# EAGLE design strobe (EAGLE 9.0.1)
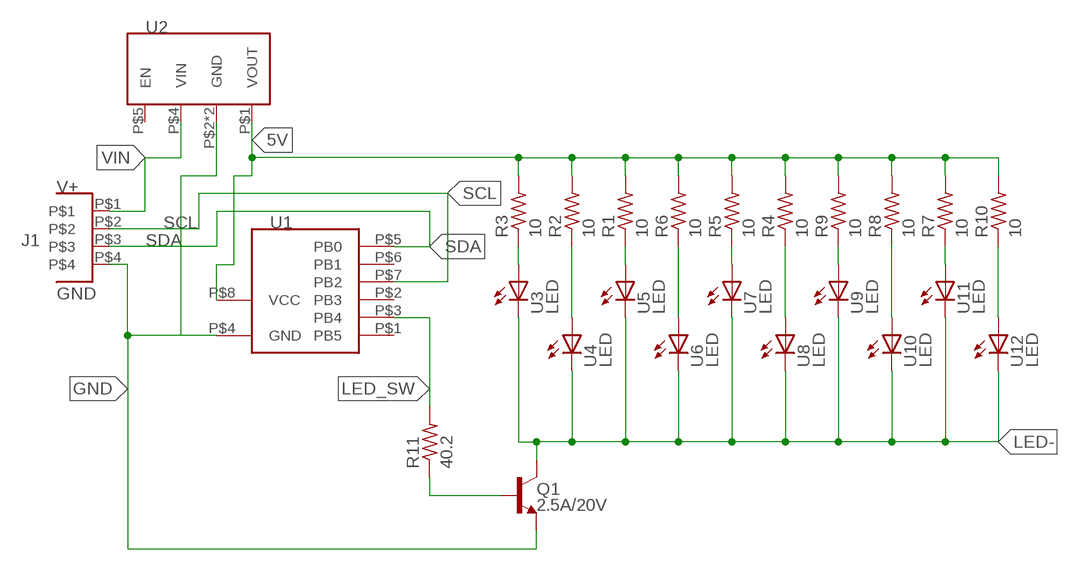
[diagram p0: schematic, sheet 1]

## Parts
J1  MOLEX-04365004  [MOLEX-43650-04]
Q1  2.5A/20V  TRANS_NPN-MMBT2222AL  [SOT23-3]
R1  10  R-US_R0805  [R0805]
R2  10  R-US_R0805  [R0805]
R3  10  R-US_R0805  [R0805]
R4  10  R-US_R0805  [R0805]
R5  10  R-US_R0805  [R0805]
R6  10  R-US_R0805  [R0805]
R7  10  R-US_R0805  [R0805]
R8  10  R-US_R0805  [R0805]
R9  10  R-US_R0805  [R0805]
R10  10  R-US_R0805  [R0805]
R11  40.2  R-US_R0805  [R0805]
U1  ATTINY85  [8P3]
U2  D24V25F5  [D24V25F5]
U3  LED  [3030]
U4  LED  [3030]
U5  LED  [3030]
U6  LED  [3030]
U7  LED  [3030]
U8  LED  [3030]
U9  LED  [3030]
U10  LED  [3030]
U11  LED  [3030]
U12  LED  [3030]

## Nets
5V: R1.2 R2.2 R3.2 R4.2 R5.2 R6.2 R7.2 R8.2 R9.2 R10.2 U1.P$8(VCC) U2.P$1(VOUT)
GND: J1.P$4 Q1.2(E) U1.P$4(GND) U2.P$2(GND) U2.P$3(GND)
LED-: Q1.3(C) U3.CATH(C) U4.CATH(C) U5.CATH(C) U6.CATH(C) U7.CATH(C) U8.CATH(C) U9.CATH(C) U10.CATH(C) U11.CATH(C) U12.CATH(C)
LED_SW: R11.2 U1.P$3(PB4)
N$5: R3.1 U3.ANODE(A)
N$7: R1.1 U5.ANODE(A)
N$8: R6.1 U6.ANODE(A)
N$9: R5.1 U7.ANODE(A)
N$10: R4.1 U8.ANODE(A)
N$11: R9.1 U9.ANODE(A)
N$12: R8.1 U10.ANODE(A)
N$13: R7.1 U11.ANODE(A)
N$14: R10.1 U12.ANODE(A)
N$16: Q1.1(B) R11.1
SCL: J1.P$2 U1.P$7(PB2)
SDA: J1.P$3 U1.P$5(PB0)
U$: R2.1 U4.ANODE(A)
VIN: J1.P$1 U2.P$4(VIN)
Unconnected: U1.P$1(PB5) U1.P$2(PB3) U1.P$6(PB1) U2.P$5(EN)

## Notes on the sheet
- U2
- V+
- SCL | U1
- J1 | SDA
- GND

## Library data of the parts
J1 = cell-pcb:MOLEX-04365004
Q1 = SparkFun-DiscreteSemi:TRANS_NPN: NPN transistor Current controlled devices typically used to amplify current or used as a switch. BC547 - COM-08928 <http://www.sparkfun.com/products/8928> (TO-92 45V 100mA) (1.Collector 2.Base 3.Emitter) 2N3904 - COM-00521 <http://www.sparkfun.com/products/521> (TO-92 40V 200mA) (1.Emitter 2.Base 3.Collector) P2N2222A - COM-12852 <http://www.sparkfun.com/products/12852> (TO-92 40V 600mA) (1.Collector 2.Base 3.Emitter); PROD_ID: TRANS-08049; VALUE: 600mA/40V
R1-R11 = rcl:R-US_: RESISTOR, American symbol; SPICEPREFIX: R
U1 = strobe:ATTINY85
U2 = strobe:D24V25F5
U3-U12 = strobe:LED

## Board
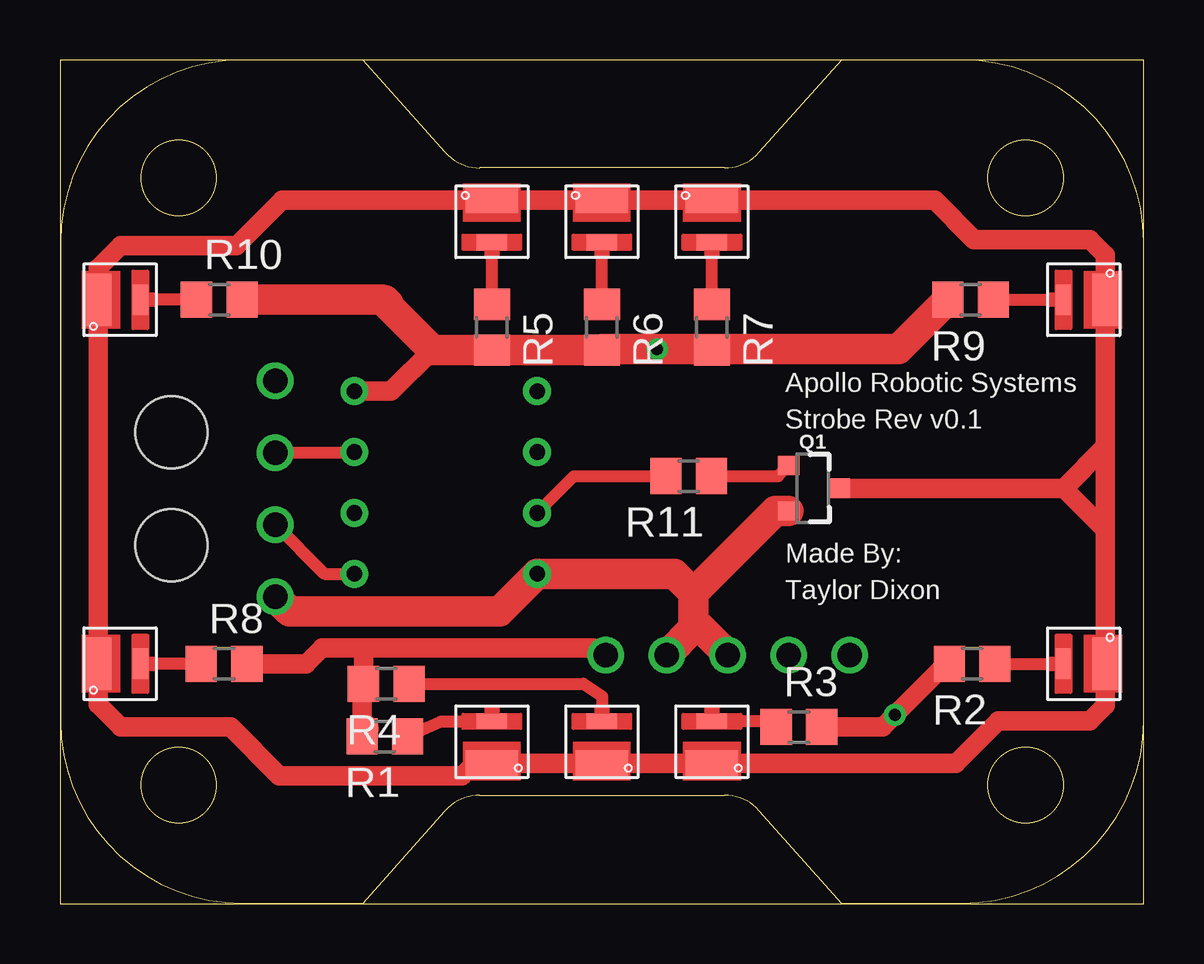
[diagram p1: board, top side]
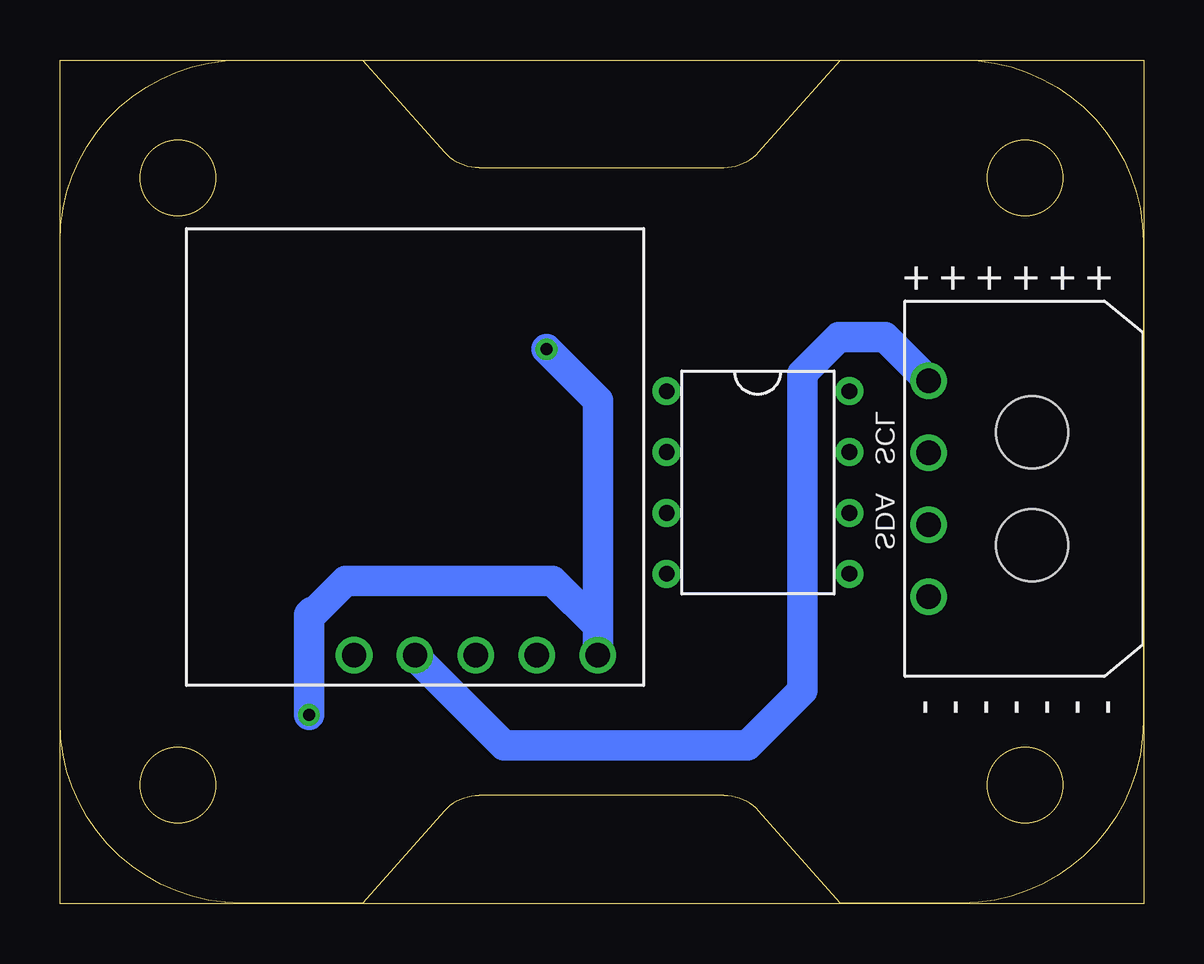
[diagram p2: board, bottom side, seen from below]

Size 45.17 x 35.17 mm. Coordinates in mm from the lower left corner, seen from the top.
Outline: 0,0 45.17,0 45.17,35.17 0,35.17 0,0
Copper layers (1*16): Top 0.035mm / dielectric 1.5mm / Bottom 0.035mm
Design rules "default": minimum track width 6mil, minimum drill 0.35mm, track to track 6mil, track to pad 6mil, pad to pad 6mil, via to via 6mil, smd to smd 6mil, copper to edge 40mil, drill to drill 6mil, minimum pad ring 10mil, minimum via ring 8mil, stop-mask expansion 4mil, vias tented up to drill 0mil, thermal gap 10mil
bKeepout: area 3.4,28.7 to 6.5,31.8; area 38.7,28.7 to 41.8,31.8; area 38.7,3.4 to 41.8,6.5; area 3.4,3.4 to 6.5,6.5; 32 lines
Milling: area 38.7,3.4 to 41.8,6.5; area 38.7,28.7 to 41.8,31.8; area 3.4,28.7 to 6.5,31.8; area 3.4,3.4 to 6.5,6.5; 20 lines

### Footprints (pad centres in the part's own frame; a part is rotated, then mirrored left to right if it is on the bottom)
MOLEX-43650-04 = drill 1.02: P$1 4.5,4.32; P$2 1.5,4.32; P$3 -1.5,4.32; P$4 -4.5,4.32 | hole 3: 2.35,0; -2.35,0
SOT23-3 = smd 0.8 x 0.9: 1 -0.95,-1; 2 0.95,-1; 3 0,1.1
R0805 = smd 1.3 x 1.5: 1 -0.95,0; 2 0.95,0
8P3 = drill 0.65: P$1 -3.81,3.81; P$2 -3.81,1.27; P$3 -3.81,-1.27; P$4 -3.81,-3.81; P$5 3.81,-3.81; P$6 3.81,-1.27; P$7 3.81,1.27; P$8 3.81,3.81
D24V25F5 = drill 1.016: P$1 17.145,1.27; P$2 14.605,1.27; P$3 12.065,1.27; P$4 9.525,1.27; P$5 6.985,1.27
3030 = smd 0.635 x 1.27: ANODE 0.85,0 | smd 1.067 x 2.184: CATH -0.9,0

### Placement (x,y rotation side)
J1  4.65,17.3 90 bottom
Q1  31.37,17.32 270 top
R1  13.54,6.98 180 top
R2  38.02,10 180 top
R3  30.8,7.37 0 top
R4  13.6,9.17 180 top
R5  18,24.03 270 top
R6  22.59,24.03 270 top
R7  27.18,24.03 270 top
R8  6.84,10 0 top
R9  37.96,25.18 180 top
R10  6.64,25.18 0 top
R11  26.21,17.83 180 top
U1  16.08,17.56 0 bottom
U2  39.9,9.1 0 bottom
U3  27.18,6.75 90 top
U4  42.67,10 180 top
U5  18,6.75 90 top
U6  22.59,28.43 270 top
U7  18,28.43 270 top
U8  22.59,6.75 90 top
U9  42.67,25.18 180 top
U10  2.5,10 0 top
U11  27.18,28.43 270 top
U12  2.5,25.18 0 top

### Tracks (layer width: path | path; a pad name or v marks a point on that pad's centre or on a via)
5V  (via drill 0.5)
  Top 0.813: U1.P$8 13.81,21.37 15.52,23.08 | R2.2 36.92,10 v34.8,7.87 34.29,7.37 R3.2 | U2.P$1 22.2,10.67 12.7,10.67 | R8.2 10.25,10 10.92,10.67 12.7,10.67 | 12.7,10.67 12.65,10.62 R4.2 12.59,9.37 R1.2
  Top 1.27: 12.65,7.29 R1.2 | R9.2 34.95,23.11 27.2,23.11 R7.2 27.14,23.11 v24.89,23.11 22.62,23.11 R6.2 R5.2 15.52,23.08 13.72,24.89 arc90 13.43,25.18 R10.2
  Bottom 1.27: v24.89,23.11 22.75,20.98 U2.P$1 22.75,11.58 24.64,13.46 33.27,13.46 34.54,12.19 arc-90 34.8,11.94 v34.8,7.87
GND
  Top 1.27: J1.P$4 9.58,12.19 18.33,12.19 U1.P$4 25.62,13.75 26.42,12.95 | U2.P$2 26.42,11.49 | 26.42,11.49 26.42,12.95 | 26.42,12.95 29.83,16.37 Q1.2 | U2.P$3 26.71,11.49 26.42,11.49
LED-
  Top 0.813: 43.58,15.59 U4.CATH 43.58,8.27 42.93,7.62 39.12,7.62 37.35,5.85 U3.CATH U8.CATH U5.CATH 17.28,5.85 16.76,5.33 9.14,5.33 7.11,7.37 2.54,7.37 1.6,8.31 U10.CATH U12.CATH 1.6,26.49 2.54,27.43 7.37,27.43 9.26,29.32 U7.CATH U6.CATH U11.CATH 36.46,29.32 38.1,27.69 42.93,27.69 43.58,27.04 U9.CATH 43.58,19.05 | 43.58,15.59 43.58,19.05 | Q1.3 41.84,17.32 | 41.84,17.32 43.58,19.05 | 41.84,17.32 43.58,15.59
LED_SW
  Top 0.508: U1.P$3 21.43,17.83 R11.2
N$5
  Top 0.508: R3.1 29.62,7.6 U3.ANODE
N$7
  Top 0.508: R1.1 15.88,7.6 U5.ANODE
N$8
  Top 0.508: R6.1 U6.ANODE
N$9
  Top 0.508: R5.1 U7.ANODE
N$10
  Top 0.508: R4.1 21.82,9.17 22.61,8.64 22.59,8.62 U8.ANODE
N$11
  Top 0.508: R9.1 U9.ANODE
N$12
  Top 0.508: R8.1 U10.ANODE
N$13
  Top 0.508: R7.1 U11.ANODE
N$14
  Top 0.508: R10.1 U12.ANODE
N$16
  Top 0.508: R11.1 29.93,17.83 Q1.1
SCL
  Top 0.508: J1.P$2 12.24,18.8 U1.P$7
SDA
  Top 0.508: J1.P$3 11.02,13.75 U1.P$5
U$
  Top 0.508: R2.1 U4.ANODE
VIN
  Bottom 1.27: J1.P$1 10.79,23.62 12.7,23.62 14.22,22.1 14.22,8.89 16.51,6.6 26.67,6.6 30.38,10.31 U2.P$4

### Text on the board
tSilk: Apollo Robotic Systems | Strobe Rev v0.1 | Made By: | Taylor Dixon
_bsilk: + | + | + | + | + | + | SCL | SDA | - | - | - | - | - | - | -